# EAGLE schematic Cyclone-Pulse-Wrangler-Display-Board (EAGLE 9.6.2)
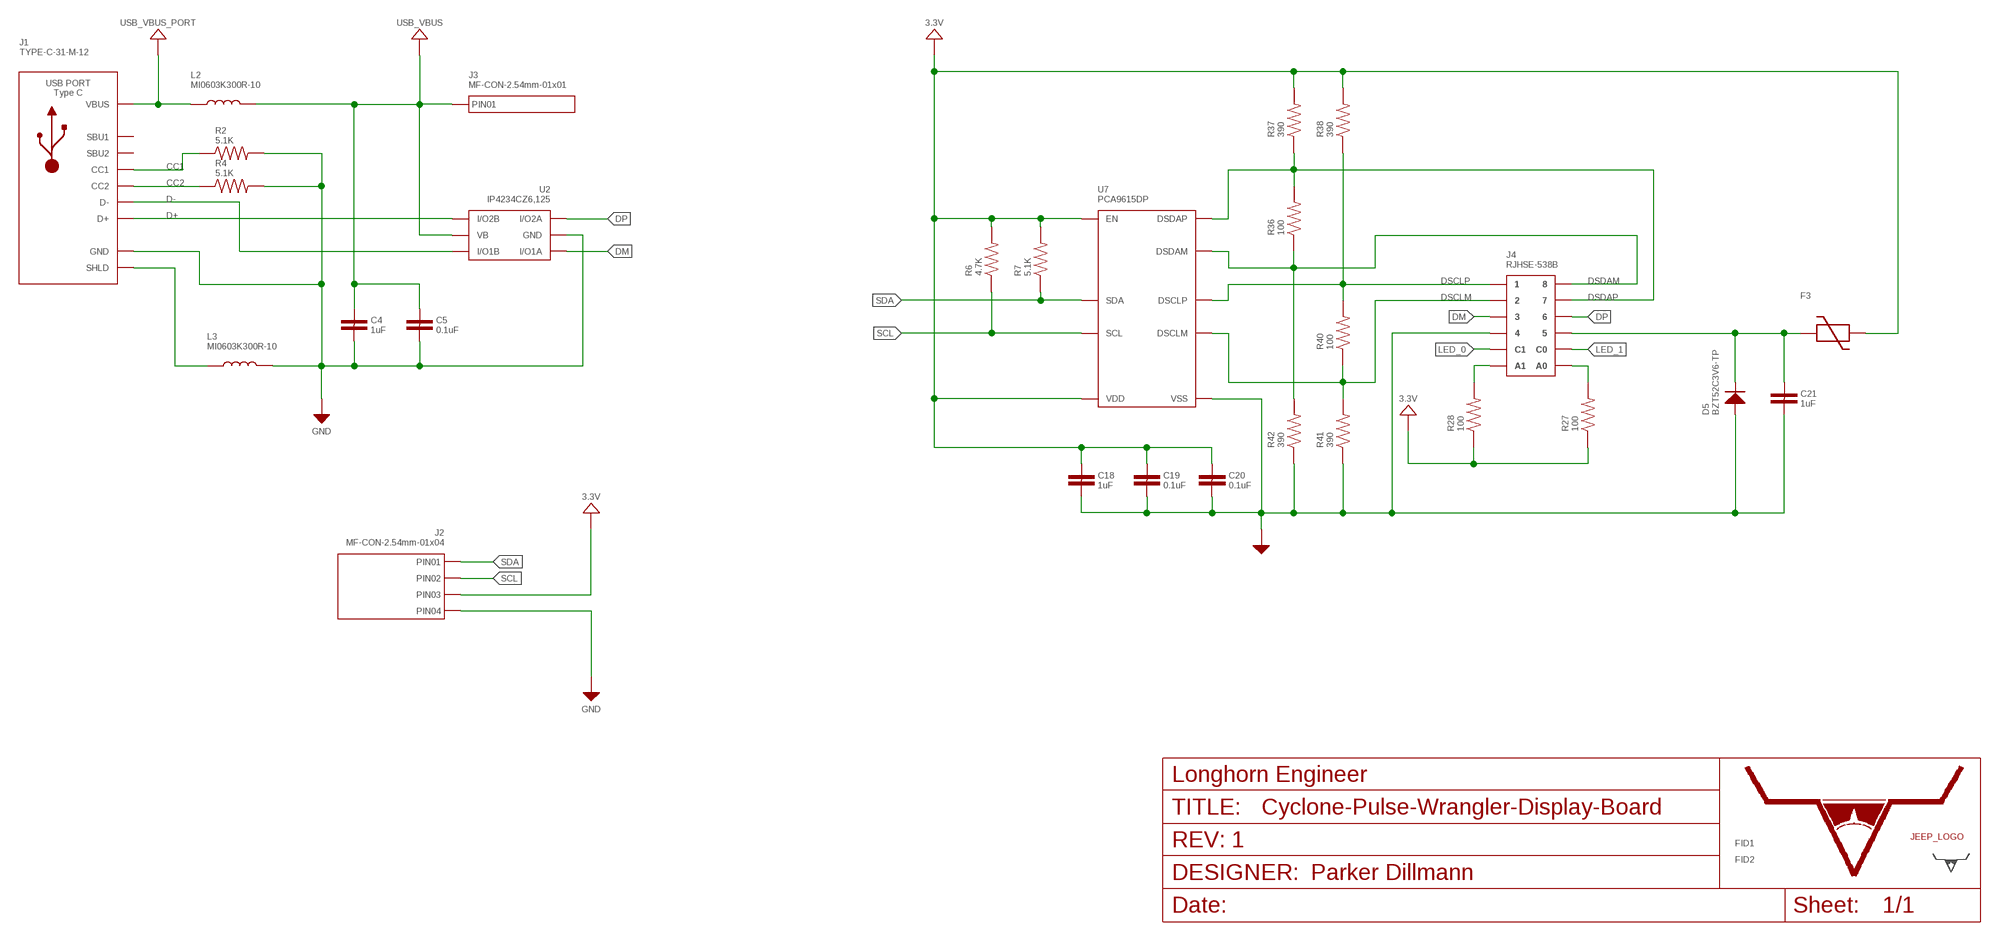
[diagram p0: schematic, sheet 1]

## Parts
C4  1uF  CAPACITOR_NON_POLAR_0805  [0805]
C5  0.1uF  CAPACITOR_NON_POLAR_0805  [0805]
C18  1uF  CAPACITOR_NON_POLAR_0805  [0805]
C19  0.1uF  CAPACITOR_NON_POLAR_0805  [0805]
C20  0.1uF  CAPACITOR_NON_POLAR_0805  [0805]
C21  1uF  CAPACITOR_NON_POLAR_0805  [0805]
D5  BZT52C3V6-TP  DIODE_SOD-123  [SOD-123]
F3  PTC_FUSE_2920  [2920]
FID1  FIDUCIAL_0.5MM  [FIDUCIAL_0.5MM]
FID2  FIDUCIAL_0.5MM  [FIDUCIAL_0.5MM]
J1  TYPE-C-31-M-12  USB_TYPE-C_MINIMAL  [TYPE-C-31-M-12]
J2  MF-CON-2.54mm-01x04  CON_01X04_PTH_2.54MM  [PTH_2.54MM_01X04]
J3  MF-CON-2.54mm-01x01  CON_01X01_PTH_2.54MM  [PTH_2.54MM_01X01]
J4  RJHSE-538B  RJ45_SINGLE_RJHSE-538X  [RJHSE-538X]
L2  MI0603K300R-10  INDUCTOR_0603  [L0603]
L3  MI0603K300R-10  INDUCTOR_0603  [L0603]
R2  5.1K  RESISTOR_0603  [R0603]
R4  5.1K  RESISTOR_0603  [R0603]
R6  4.7K  RESISTOR_0603  [R0603]
R7  5.1K  RESISTOR_0603  [R0603]
R27  100  RESISTOR_0603  [R0603]
R28  100  RESISTOR_0603  [R0603]
R36  100  RESISTOR_0603  [R0603]
R37  390  RESISTOR_0603  [R0603]
R38  390  RESISTOR_0603  [R0603]
R40  100  RESISTOR_0603  [R0603]
R41  390  RESISTOR_0603  [R0603]
R42  390  RESISTOR_0603  [R0603]
U2  IP4234CZ6,125  IP4234CZ6  [IP4234CZ6_SOT-457-6]
U7  PCA9615DP  [PCA9615DP_TSSOP-10]
U$1  LHE_FRAME  [LHE_FRAME]
U$35  JEEP_LOGO_SILK_MEDIUM  [JEEP_SILK_MEDIUM]
U$42  LHE_LOGOLHE_LOGO  [LHE_LOGO]

## Nets
3.3V: C18.1 C19.1 C20.1 F3.2 J2.P$3(PIN3) R6.P$2 R7.P$2 R37.P$2 R38.P$2 U7.P$1(VDD) U7.P$3(EN) U7.P$10(VDD)
3.3V_SCREEN_OUT: C21.1 D5.1(CATHODE) F3.1 J4.5
CC1: J1.A5(CC1) R2.P$1
CC2: J1.B5(CC2) R4.P$1
D+: J1.A6(D+) J1.B6(D+) U2.4(I/O2B)
D-: J1.A7(D-) J1.B7(D-) U2.3(I/O1B)
DM: J4.3 U2.1(I/O1A)
DP: J4.6 U2.6(I/O2A)
DSCLM: J4.2 R40.P$1 R41.P$2 U7.P$6(DSCLM)
DSCLP: J4.1 R38.P$1 R40.P$2 U7.P$7(DSCLP)
DSDAM: J4.8 R36.P$1 R42.P$2 U7.P$9(DSDAM)
DSDAP: J4.7 R36.P$2 R37.P$1 U7.P$8(DSDAP)
GND: C4.2 C5.2 C18.2 C19.2 C20.2 C21.2 D5.2(ANODE) J1.A1/B12(GND) J1.B1/A12(GND) J2.P$4(PIN4) J4.4 L3.P$2 R2.P$2 R4.P$2 R41.P$1 R42.P$1 U2.2(GND) U7.P$5(VSS)
LED_0: J4.11(C1)
LED_1: J4.9(C0)
N$11: J4.12(A1) R28.P$2
N$12: J4.10(A0) R27.P$2
P$1: R27.P$1 R28.P$1 ; supply symbol labelled 3.3V
SCL: J2.P$2(PIN2) R6.P$1 U7.P$4(SCL)
SDA: J2.P$1(PIN1) R7.P$1 U7.P$2(SDA)
SHLD: J1.MT_B_0(SHLD) J1.MT_B_1(SHLD) J1.MT_B_2(SHLD) J1.MT_B_3(SHLD) J1.MT_T_0(SHLD) J1.MT_T_1(SHLD) J1.MT_T_2(SHLD) J1.MT_T_3(SHLD) L3.P$1
USB_VBUS: C4.1 C5.1 J3.P$1(PIN1) L2.P$2 U2.5(VB)
USB_VBUS_PORT: J1.A4/B9(VBUS) J1.B4/A9(VBUS) L2.P$1
Unconnected: J1.A8(SBU1) J1.B8(SBU2)

## Library data of the parts
C4 = PP_Passives:CAPACITOR_NON_POLAR: Capacitor Non Polarized; MPN: C0805X105K5RACAUTO
C5 = PP_Passives:CAPACITOR_NON_POLAR: Capacitor Non Polarized
C18 C21 = PP_Passives:CAPACITOR_NON_POLAR: Capacitor Non Polarized; MPN: C0805X105K5RACAUTO; SPICEPREFIX: C
C19 C20 = PP_Passives:CAPACITOR_NON_POLAR: Capacitor Non Polarized; SPICEPREFIX: C
D5 = PP_Passives:DIODE: Diode - Single; SPICEPREFIX: D
F3 = PP_Passives:PTC_FUSE; SPICEPREFIX: F
FID1 FID2 = MF_Aesthetics:FIDUCIAL: Library: MF_Aesthetics Description: Fiducial marking for PCB alignment inside PNP and other machines.; HOUSEPART: NO; POPULATE: 0
J1 = PP_Connectors:USB_TYPE-C_MINIMAL; MPN: TYPE-C-31-M-12; POPULATE: 1
J2 = MF_Connectors:CON_01X04: Library: MF_Connectors Description: Header Connector with 04 Positions and 01 Rows. Use the LABEL Attribute to label the pin on the schematic and PCB. You can remove the attributes on the PCB by using the SMASH function on the part and then deleting the text.; HOUSEPART: YES; MPN: MF-CON-2.54mm-01x04; POPULATE: 1; URL: https://factory.macrofab.com/part/MF-CON-2.54mm-01x04
J3 = MF_Connectors:CON_01X01: Library: MF_Connectors Description: Header Connector with 01 Positions and 01 Rows. Use the LABEL Attribute to label the pin on the schematic and PCB. You can remove the attributes on the PCB by using the SMASH function on the part and then deleting the text.; HOUSEPART: YES; MPN: MF-CON-2.54mm-01x01; POPULATE: 1; URL: https://factory.macrofab.com/part/MF-CON-2.54mm-01x01
J4 = PP_Connectors:RJ45_SINGLE: RJ45 Connectors - Single; POPULATE: 1; SPICEPREFIX: X
L2 L3 = MF_Passives:INDUCTOR: Library: MF_Passives Description: Device for Inductors. Manufacture part number (MPN) can be added via Attributes. Check https://factory.macrofab.com/parts for the house parts list.; MPN: MI0603K300R-10; POPULATE: 1
R2 R4 = MF_Passives:RESISTOR: Library: MF_Passives Description: Device for Resistors. Manufacture part number (MPN), Voltage, Tolerance, and Wattage Rating can be added via Attributes. Check https://factory.macrofab.com/parts for the house parts list.; POPULATE: 1
R6 R7 R27 R28 = MF_Passives:RESISTOR: Library: MF_Passives Description: Device for Resistors. Manufacture part number (MPN), Voltage, Tolerance, and Wattage Rating can be added via Attributes. Check https://factory.macrofab.com/parts for the house parts list.; MPN: MF-RES-0603-100; POPULATE: 1; SPICEPREFIX: R
R36-R38 R40-R42 = MF_Passives:RESISTOR: Library: MF_Passives Description: Device for Resistors. Manufacture part number (MPN), Voltage, Tolerance, and Wattage Rating can be added via Attributes. Check https://factory.macrofab.com/parts for the house parts list.; POPULATE: 1; SPICEPREFIX: R
U2 = PP_Passives:IP4234CZ6: Mouser Part #: 771-IP4234CZ6125 Manufacturer Part #: IP4234CZ6,125 Manufacturer: NXP Semiconductors Description: ESD Suppressors Single USB 2.0 ESD Protection 6-Pin http://www.mouser.com/ProductDetail/NXP-Semiconductors/IP4234CZ6125/?qs=sGAEpiMZZMvxHShE6Whpu7QUdHOfUl1T0xbl582qhFk%3d; MPN: IP4234CZ6,125; POPULATE: 1
U7 = PP_DigitalIC:PCA9615; SPICEPREFIX: X
U$1 = PP_Aesthetics:LHE_FRAME; DNAME: Parker Dillmann; REVNUM: REV: 1
U$35 = PP_Aesthetics:JEEP_LOGO
U$42 = PP_Aesthetics:LHE_LOGO